# Altium project MotorDriver.PrjPcb
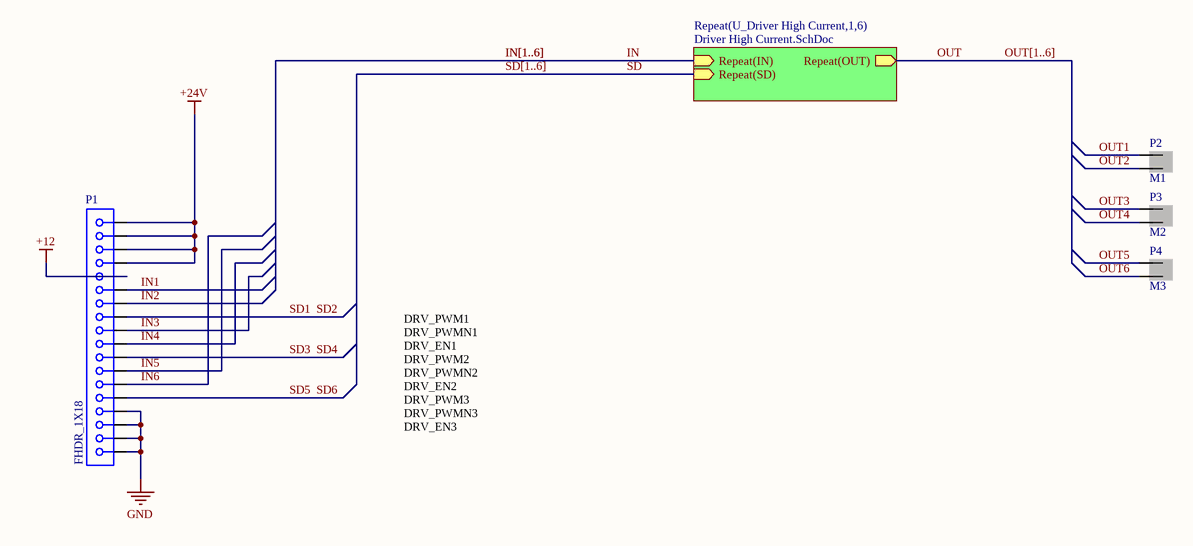
[diagram p0: main.SchDoc]
2 sheets, 64 parts. Net scope: hierarchical (ports join the sheet entries above them; power ports are global).
Board file: Motor Driver.PcbDoc
Sheets:
  main.SchDoc
    U_Driver High Current1 = Driver High Current.SchDoc
    U_Driver High Current2 = Driver High Current.SchDoc
    U_Driver High Current3 = Driver High Current.SchDoc
    U_Driver High Current4 = Driver High Current.SchDoc
    U_Driver High Current5 = Driver High Current.SchDoc
    U_Driver High Current6 = Driver High Current.SchDoc

## Sheet main.SchDoc
size A; SheetNumber: 1; SheetTotal: 2

### Parts
P1  FHDR_1X18  [FHDR1X18-254P]
P2  M1  [ATX 2PIN]
P3  M2  [ATX 2PIN]
P4  M3  [ATX 2PIN]

### Sub-sheets
Repeat(U_Driver High Current,1,6) = Driver High Current.SchDoc: Repeat(IN) (in), Repeat(SD) (in), Repeat(OUT) (out)

### Nets
+12: P1.5
+24V: P1.1 P1.2 P1.3 P1.4
GND: P1.15 P1.16 P1.17 P1.18
IN: sheet Repeat(U_Driver High Current,1,6)/Repeat(IN)
IN1: P1.6
IN2: P1.7
IN3: P1.9
IN4: P1.10
IN5: P1.12
IN6: P1.13
OUT: sheet Repeat(U_Driver High Current,1,6)/Repeat(OUT)  [also labelled OUT[1..6]]
OUT1: P2.1  [also labelled OUT[1..6]1]
OUT2: P2.2  [also labelled OUT[1..6]2]
OUT3: P3.1  [also labelled OUT[1..6]3]
OUT4: P3.2  [also labelled OUT[1..6]4]
OUT5: P4.1  [also labelled OUT[1..6]5]
OUT6: P4.2  [also labelled OUT[1..6]6]
SD: sheet Repeat(U_Driver High Current,1,6)/Repeat(SD)
SD1: P1.8  [also labelled SD2]
SD3: P1.11  [also labelled SD4]
SD5: P1.14  [also labelled SD6]

### Buses and harness runs
bus IN[1..6]
bus SD[1..6]

### Notes on the sheet
- DRV_PWM1
  DRV_PWMN1
  DRV_EN1
  DRV_PWM2
  DRV_PWMN2
  DRV_EN2
  DRV_PWM3
  DRV_PWMN3
  DRV_EN3

### Library data of the parts
P1 = FHDR_1X18: Female Header 1X18
P2-P4 = ATX 2PIN

## Sheet Driver High Current.SchDoc
size A; SheetNumber: 2; SheetTotal: 2
Used 6 times, as channels U_Driver High Current1, U_Driver High Current2, U_Driver High Current3, U_Driver High Current4, U_Driver High Current5, U_Driver High Current6. Parts and nets are listed once, with the designators drawn on the sheet.
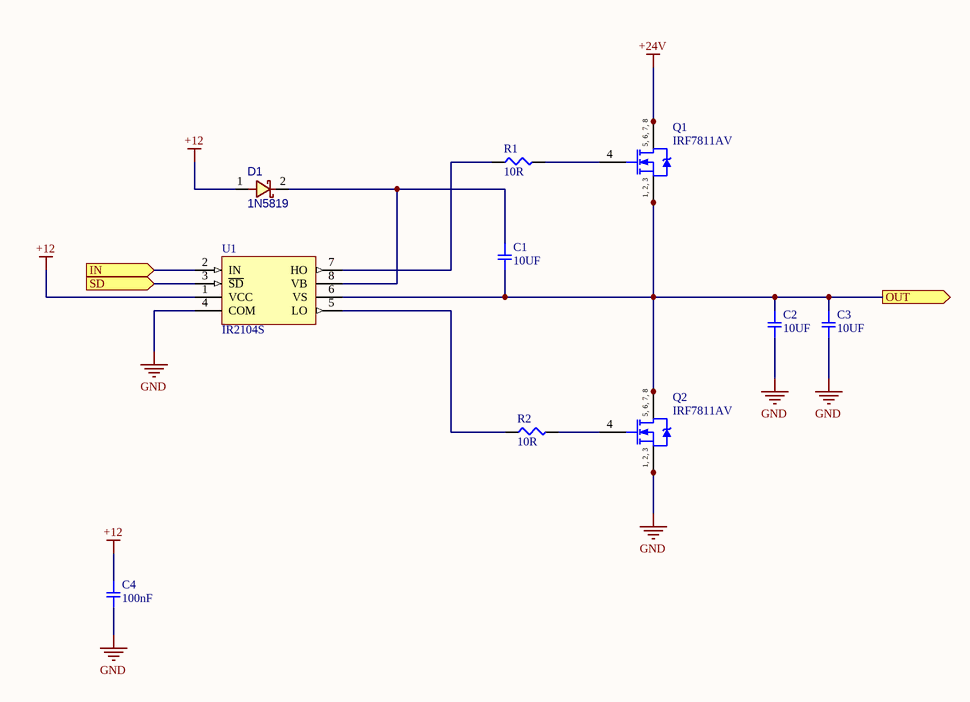
[diagram p1: Driver High Current.SchDoc]

### Parts
C1  10UF  [SMD-1206C]
C2  10UF  [SMD-1206C]
C3  10UF  [SMD-1206C]
C4  100nF  [SMD-0805C]
D1  1N5819  [D_SOD123W]
Q1  IRF7811AV  [SOIC-8]
Q2  IRF7811AV  [SOIC-8]
R1  10R  [SMD-0805-RES]
R2  10R  [SMD-0805-RES]
U1  IR2104S  [SOIC-8]

### Ports
IN (in), OUT (out), SD (in)

### Nets
+12: C4.1 D1.1 U1.1(VCC)
+24V: Q1.5(D) Q1.6(D) Q1.7(D) Q1.8(D)
GND: C2.2 C3.2 C4.2 Q2.1(S) Q2.2(S) Q2.3(S) U1.4(COM)
IN: U1.2(IN) ; port IN
OUT: C1.2 C2.1 C3.1 Q1.1(S) Q1.2(S) Q1.3(S) Q2.5(D) Q2.6(D) Q2.7(D) Q2.8(D) U1.6(VS) ; port OUT
SD: U1.3(~{SD}) ; port SD
NetC1_1: C1.1 D1.2 U1.8(VB)
NetQ1_4: Q1.4(G) R1.2
NetQ2_4: Q2.4(G) R2.2
NetR1_1: R1.1 U1.7(HO)
NetR2_1: R2.1 U1.5(LO)

### Channels
U_Driver High Current1: designators end in _U_Driver_High_Current1; ports IN=IN1 OUT=OUT1 SD=SD1
U_Driver High Current2: designators end in _U_Driver_High_Current2; ports IN=IN2 OUT=OUT2 SD=SD1
U_Driver High Current3: designators end in _U_Driver_High_Current3; ports IN=IN3 OUT=OUT3 SD=SD3
U_Driver High Current4: designators end in _U_Driver_High_Current4; ports IN=IN4 OUT=OUT4 SD=SD3
U_Driver High Current5: designators end in _U_Driver_High_Current5; ports IN=IN5 OUT=OUT5 SD=SD5
U_Driver High Current6: designators end in _U_Driver_High_Current6; ports IN=IN6 OUT=OUT6 SD=SD5

### Notes on the sheet
- (in symbol IRF7811AV) 5, 6, 7, 8; 1, 2, 3

### Library data of the parts
C1-C3 = GC331AD72E333KX01D: CAP CER 10UF 250V X7T 1206; Manufacturer: Murata Electronics North America; Factory Stock: 0; Unit Price (USD): 0.33; Minimum Quantity: 1; Value: 0.033µF; Tolerance: ±10%; Datasheets: http://search.murata.co.jp/Ceramy/image/img/A01X/G101/ENG/GC331AD72E333KX01-01.pdf; Image: //media.digikey.com/Renders/Murata%20Renders/1206(GC3)320x160.jpg; Digi-Key Part Number: 490-13989-1-ND; Part Number: GC331AD72E333KX01D; Quantity Available: 3999; @ qty: 0; Packaging: Cut Tape (CT); Series: GC3; Part Status: Active; Voltage: 250V; Temperature Coefficient: X7T; Operating Temperature: -55°C ~ 125°C; Features: -; Ratings: AEC-Q200; Applications: Automotive; Mounting Type: Surface Mount, MLCC; Package / Case: 1206 (3216 Metric); Size / Dimension: 0.126" L x 0.063" W (3.20mm x 1.60mm); Height - Seated (Max): -; Thickness (Max): 0.039" (1.00mm); Lead Spacing: -; Lead Style: -
C4 = GC321AD72E103KX01D: CAP CER 100nF 50V X7T 0805; Manufacturer: Murata Electronics North America; Factory Stock: 0; Unit Price (USD): 0.3; Minimum Quantity: 1; Value: 10000pF; Tolerance: ±10%; Voltage: 250V; Datasheets: http://search.murata.co.jp/Ceramy/image/img/A01X/G101/ENG/GC321AD72E103KX01-01.pdf; Image: //media.digikey.com/Renders/Murata%20Renders/0805(GC3)200x125.jpg; Digi-Key Part Number: 490-13986-1-ND; Part Number: GC321AD72E103KX01D; Quantity Available: 4000; @ qty: 0; Packaging: Cut Tape (CT); Series: GC3; Part Status: Active; Temperature Coefficient: X7T; Operating Temperature: -55°C ~ 125°C; Features: -; Ratings: AEC-Q200; Applications: Automotive; Mounting Type: Surface Mount, MLCC; Package / Case: 0805 (2012 Metric); Size / Dimension: 0.079" L x 0.049" W (2.00mm x 1.25mm); Height - Seated (Max): -; Thickness (Max): 0.039" (1.00mm); Lead Spacing: -; Lead Style: -
D1 = DIODE_SMD_SCHOTTKY_1N5819: DIODE, SCHOTTKY, 40V, 1A; MANF: DIODES; MANF_P#: 1N5819HW-7-F; DESC: DESCRIPTION; ASSEMBLY: ASSEMBLY; PRICE: PRICE; PARAM2: 1A; PARAM: 40V; VALUE: 1N5819
Q1 Q2 = IRF7811AV: HEXFET Power MOSFET; Published: 17-Sep-2003; LatestRevisionDate: 13-Apr-2006; LatestRevisionNote: IPC-7351 Footprint Added.; DatasheetVersion: 13-Dec-2000; PackageVersion: Feb-2001; PackageReference: SO-8; Publisher: Altium Limited; PackageDescription: 8-Pin Plastic Small Outline Integrated Circuit 1.27 mm Pitch; Code_JEDEC: MS-012-AA; Code_IPC: SOIC127P600-8; ComponentLink1Description: Manufacturer Link; ComponentLink1URL: http://www.irf.com/; ComponentLink2Description: Datasheet; ComponentLink2URL: http://www.irf.com/product-info/datasheets/data/irf7811av.pdf
R1 R2 = ERJ-6BQF1R0V: RES SMD 10R OHM 1% 1/3W 0805; Manufacturer: Panasonic Electronic Components; Factory Stock: 0; Unit Price (USD): 0.05834; @ qty: 1500; Minimum Quantity: 1; Value: 1; Power (Watts): 0.333W, 1/3W; Temperature Coefficient: ±200ppm/°C; Part Number: ERJ-6BQF1R0V; Datasheets: https://industrial.panasonic.com/cdbs/www-data/pdf/RDA0000/AOA0000C239.pdf; Image: //media.digikey.com/Renders/Panasonic%20Renders/ERJ-0805%20Pkg.jpg; Digi-Key Part Number: P17499CT-ND; Quantity Available: 808; Packaging: Cut Tape (CT); Series: ERJ; Part Status: Active; Tolerance: ±1%; Composition: Thick Film; Features: Automotive AEC-Q200, Current Sense; Operating Temperature: -55°C ~ 125°C; Package / Case: 0805 (2012 Metric); Supplier Device Package: 0805; Size / Dimension: 0.079" L x 0.049" W (2.00mm x 1.25mm); Height - Seated (Max): 0.028" (0.70mm); Number of Terminations: 2; Failure Rate: -
U1 = IR2104S: High and Low Side Driver; Published: 8-Jun-2000; LatestRevisionDate: 13-Apr-2006; LatestRevisionNote: IPC-7351 Footprint Added.; DatasheetVersion: PD600461; PackageVersion: Feb-2001; PackageReference: SO-8; Publisher: Altium Limited; PackageDescription: 8-Pin Plastic Small Outline Integrated Circuit 1.27 mm Pitch; Code_JEDEC: MS-012-AA; Code_IPC: SOIC127P600-8; ComponentLink1Description: Manufacturer Link; ComponentLink1URL: http://www.irf.com/; ComponentLink2Description: Datasheet; ComponentLink2URL: http://www.irf.com/product-info/datasheets/data/ir2104.pdf

## Nets that join several sheets
+12: main (P1.5), U_Driver High Current1 (C4_U_Driver_High_Current1.1 D1_U_Driver_High_Current1.1 U1_U_Driver_High_Current1.1), U_Driver High Current2 (C4_U_Driver_High_Current2.1 D1_U_Driver_High_Current2.1 U1_U_Driver_High_Current2.1), U_Driver High Current3 (C4_U_Driver_High_Current3.1 D1_U_Driver_High_Current3.1 U1_U_Driver_High_Current3.1), U_Driver High Current4 (C4_U_Driver_High_Current4.1 D1_U_Driver_High_Current4.1 U1_U_Driver_High_Current4.1), U_Driver High Current5 (C4_U_Driver_High_Current5.1 D1_U_Driver_High_Current5.1 U1_U_Driver_High_Current5.1), U_Driver High Current6 (C4_U_Driver_High_Current6.1 D1_U_Driver_High_Current6.1 U1_U_Driver_High_Current6.1)
+24V: main (P1.1 P1.2 P1.3 P1.4), U_Driver High Current1 (Q1_U_Driver_High_Current1.5 Q1_U_Driver_High_Current1.6 Q1_U_Driver_High_Current1.7 Q1_U_Driver_High_Current1.8), U_Driver High Current2 (Q1_U_Driver_High_Current2.5 Q1_U_Driver_High_Current2.6 Q1_U_Driver_High_Current2.7 Q1_U_Driver_High_Current2.8), U_Driver High Current3 (Q1_U_Driver_High_Current3.5 Q1_U_Driver_High_Current3.6 Q1_U_Driver_High_Current3.7 Q1_U_Driver_High_Current3.8), U_Driver High Current4 (Q1_U_Driver_High_Current4.5 Q1_U_Driver_High_Current4.6 Q1_U_Driver_High_Current4.7 Q1_U_Driver_High_Current4.8), U_Driver High Current5 (Q1_U_Driver_High_Current5.5 Q1_U_Driver_High_Current5.6 Q1_U_Driver_High_Current5.7 Q1_U_Driver_High_Current5.8), U_Driver High Current6 (Q1_U_Driver_High_Current6.5 Q1_U_Driver_High_Current6.6 Q1_U_Driver_High_Current6.7 Q1_U_Driver_High_Current6.8)
GND: main (P1.15 P1.16 P1.17 P1.18), U_Driver High Current1 (7 pins), U_Driver High Current2 (7 pins), U_Driver High Current3 (7 pins), U_Driver High Current4 (7 pins), U_Driver High Current5 (7 pins), U_Driver High Current6 (7 pins)
IN1: main (P1.6), U_Driver High Current1 (U1_U_Driver_High_Current1.2)
IN2: main (P1.7), U_Driver High Current2 (U1_U_Driver_High_Current2.2)
IN3: main (P1.9), U_Driver High Current3 (U1_U_Driver_High_Current3.2)
IN4: main (P1.10), U_Driver High Current4 (U1_U_Driver_High_Current4.2)
IN5: main (P1.12), U_Driver High Current5 (U1_U_Driver_High_Current5.2)
IN6: main (P1.13), U_Driver High Current6 (U1_U_Driver_High_Current6.2)
OUT1: main (P2.1), U_Driver High Current1 (11 pins)
OUT2: main (P2.2), U_Driver High Current2 (11 pins)
OUT3: main (P3.1), U_Driver High Current3 (11 pins)
OUT4: main (P3.2), U_Driver High Current4 (11 pins)
OUT5: main (P4.1), U_Driver High Current5 (11 pins)
OUT6: main (P4.2), U_Driver High Current6 (11 pins)
SD1: main (P1.8), U_Driver High Current1 (U1_U_Driver_High_Current1.3), U_Driver High Current2 (U1_U_Driver_High_Current2.3)
SD3: main (P1.11), U_Driver High Current3 (U1_U_Driver_High_Current3.3), U_Driver High Current4 (U1_U_Driver_High_Current4.3)
SD5: main (P1.14), U_Driver High Current5 (U1_U_Driver_High_Current5.3), U_Driver High Current6 (U1_U_Driver_High_Current6.3)